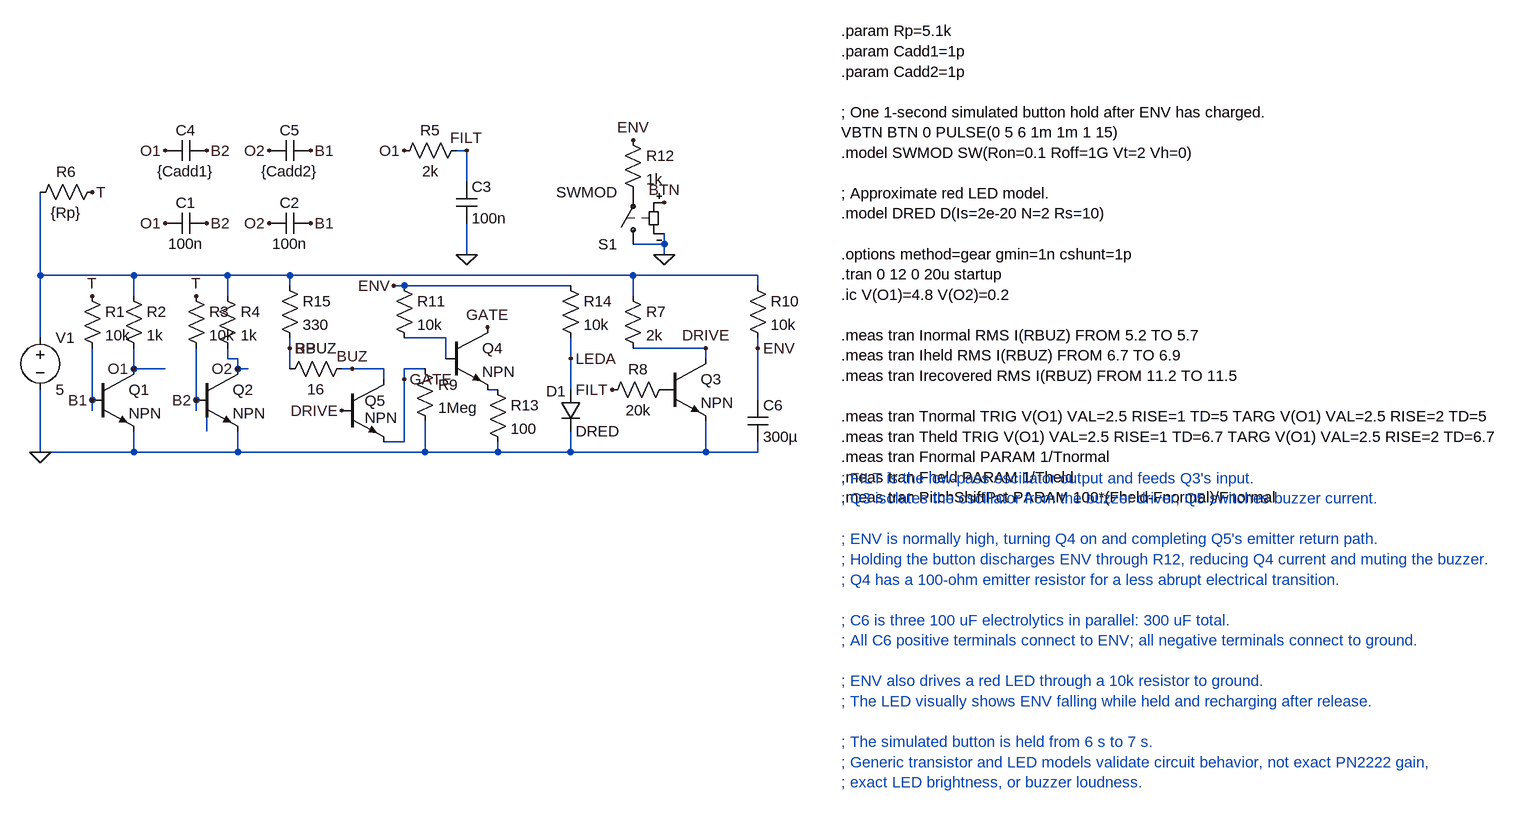
[diagram p0: schematic analog-oscillator-v8.asc]
analog-oscillator-v8.asc, the LTspice schematic file:
Version 4.1
SHEET 1 3092 936
WIRE 768 -224 752 -224
WIRE 768 -176 768 -224
WIRE 1072 -80 1072 -96
WIRE 1072 -80 1024 -80
WIRE 768 -64 768 -112
WIRE 1072 -64 1072 -80
WIRE 112 -32 112 -160
WIRE 256 -32 112 -32
WIRE 400 -32 256 -32
WIRE 496 -32 400 -32
WIRE 1024 -32 496 -32
WIRE 1216 -32 1024 -32
WIRE 496 -16 496 -32
WIRE 672 -16 656 -16
WIRE 928 -16 672 -16
WIRE 1216 -16 1216 -32
WIRE 256 0 256 -32
WIRE 400 0 400 -32
WIRE 1024 0 1024 -32
WIRE 112 64 112 -32
WIRE 736 64 672 64
WIRE 496 80 496 64
WIRE 1136 80 1024 80
WIRE 1216 80 1216 64
WIRE 400 96 400 80
WIRE 416 96 400 96
WIRE 736 96 736 64
WIRE 928 96 928 64
WIRE 1136 96 1136 80
WIRE 256 112 256 80
WIRE 304 112 256 112
WIRE 416 112 416 96
WIRE 432 112 416 112
WIRE 496 112 496 80
WIRE 592 112 576 112
WIRE 640 112 592 112
WIRE 704 112 672 112
WIRE 640 128 640 112
WIRE 672 128 672 112
WIRE 816 144 800 144
WIRE 928 144 928 96
WIRE 192 160 192 80
WIRE 352 160 352 80
WIRE 1216 160 1216 80
WIRE 192 176 192 160
WIRE 352 176 352 160
WIRE 368 208 368 160
WIRE 672 224 672 128
WIRE 672 224 640 224
WIRE 112 240 112 144
WIRE 256 240 256 208
WIRE 256 240 112 240
WIRE 416 240 416 208
WIRE 416 240 256 240
WIRE 704 240 704 192
WIRE 704 240 416 240
WIRE 816 240 816 224
WIRE 816 240 704 240
WIRE 928 240 928 208
WIRE 928 240 816 240
WIRE 1136 240 1136 192
WIRE 1136 240 928 240
WIRE 1216 240 1216 224
WIRE 1216 240 1136 240
FLAG 112 240 0
FLAG 256 112 O1
FLAG 416 112 O2
FLAG 464 -112 O2
FLAG 304 -112 O1
FLAG 192 160 B1
FLAG 368 -112 B2
FLAG 352 160 B2
FLAG 528 -112 B1
FLAG 672 -224 O1
FLAG 768 -224 FILT
FLAG 768 -64 0
FLAG 192 -160 T
FLAG 304 -224 O1
FLAG 368 -224 B2
FLAG 464 -224 O2
FLAG 528 -224 B1
FLAG 192 0 T
FLAG 352 0 T
FLAG 496 80 BP
FLAG 592 112 BUZ
FLAG 576 176 DRIVE
FLAG 1136 80 DRIVE
FLAG 992 144 FILT
FLAG 672 128 GATE
FLAG 1216 80 ENV
FLAG 800 48 GATE
FLAG 656 -16 ENV
FLAG 1072 -64 0
FLAG 1072 -144 BTN
FLAG 1024 -240 ENV
FLAG 928 96 LEDA
SYMBOL voltage 112 48 R0
WINDOW 123 0 0 Left 0
WINDOW 39 0 0 Left 0
SYMATTR InstName V1
SYMATTR Value 5
SYMBOL res 176 -16 R0
SYMATTR InstName R1
SYMATTR Value 10k
SYMBOL res 240 -16 R0
SYMATTR InstName R2
SYMATTR Value 1k
SYMBOL res 336 -16 R0
SYMATTR InstName R3
SYMATTR Value 10k
SYMBOL res 384 -16 R0
SYMATTR InstName R4
SYMATTR Value 1k
SYMBOL npn 192 112 R0
SYMATTR InstName Q1
SYMBOL npn 352 112 R0
SYMATTR InstName Q2
SYMBOL cap 304 -96 R270
WINDOW 0 32 32 VTop 2
WINDOW 3 0 32 VBottom 2
SYMATTR InstName C1
SYMATTR Value 100n
SYMBOL cap 464 -96 R270
WINDOW 0 32 32 VTop 2
WINDOW 3 0 32 VBottom 2
SYMATTR InstName C2
SYMATTR Value 100n
SYMBOL res 768 -240 R90
WINDOW 0 0 56 VBottom 2
WINDOW 3 32 56 VTop 2
SYMATTR InstName R5
SYMATTR Value 2k
SYMBOL cap 752 -176 R0
SYMATTR InstName C3
SYMATTR Value 100n
SYMBOL res 96 -144 R270
WINDOW 0 32 56 VTop 2
WINDOW 3 0 56 VBottom 2
SYMATTR InstName R6
SYMATTR Value {Rp}
SYMBOL cap 368 -240 R90
WINDOW 0 0 32 VBottom 2
WINDOW 3 32 32 VTop 2
SYMATTR InstName C4
SYMATTR Value {Cadd1}
SYMBOL cap 528 -240 R90
WINDOW 0 0 32 VBottom 2
WINDOW 3 32 32 VTop 2
SYMATTR InstName C5
SYMATTR Value {Cadd2}
SYMBOL npn 576 128 R0
WINDOW 0 35 33 Left 2
WINDOW 3 35 59 Left 2
SYMATTR InstName Q5
SYMBOL res 480 -32 R0
SYMATTR InstName R15
SYMATTR Value 330
SYMBOL res 592 96 R90
WINDOW 0 0 56 VBottom 2
WINDOW 3 32 56 VTop 2
SYMATTR InstName RBUZ
SYMATTR Value 16
SYMBOL npn 736 48 R0
SYMATTR InstName Q4
SYMBOL npn 1072 96 R0
SYMATTR InstName Q3
SYMBOL res 1008 -16 R0
SYMATTR InstName R7
SYMATTR Value 2k
SYMBOL res 1088 128 R90
WINDOW 0 0 56 VBottom 2
WINDOW 3 32 56 VTop 2
SYMATTR InstName R8
SYMATTR Value 20k
SYMBOL res 688 96 R0
SYMATTR InstName R9
SYMATTR Value 1Meg
SYMBOL res 1200 -32 R0
SYMATTR InstName R10
SYMATTR Value 10k
SYMBOL cap 1200 160 R0
SYMATTR InstName C6
SYMATTR Value 300µ
SYMBOL res 656 -32 R0
SYMATTR InstName R11
SYMATTR Value 10k
SYMBOL sw 1024 -64 R180
SYMATTR InstName S1
SYMATTR Value SWMOD
SYMBOL res 1008 -256 R0
SYMATTR InstName R12
SYMATTR Value 1k
SYMBOL res 800 128 R0
SYMATTR InstName R13
SYMATTR Value 100
SYMBOL res 912 -32 R0
SYMATTR InstName R14
SYMATTR Value 10k
SYMBOL diode 912 144 R0
WINDOW 0 -22 2 Left 2
SYMATTR InstName D1
SYMATTR Value DRED
TEXT 1344 -408 Left 2 !.param Rp=5.1k\n.param Cadd1=1p\n.param Cadd2=1p\n \n; One 1-second simulated button hold after ENV has charged.\nVBTN BTN 0 PULSE(0 5 6 1m 1m 1 15)\n.model SWMOD SW(Ron=0.1 Roff=1G Vt=2 Vh=0)\n \n; Approximate red LED model.\n.model DRED D(Is=2e-20 N=2 Rs=10)\n \n.options method=gear gmin=1n cshunt=1p\n.tran 0 12 0 20u startup\n.ic V(O1)=4.8 V(O2)=0.2\n \n.meas tran Inormal RMS I(RBUZ) FROM 5.2 TO 5.7\n.meas tran Iheld RMS I(RBUZ) FROM 6.7 TO 6.9\n.meas tran Irecovered RMS I(RBUZ) FROM 11.2 TO 11.5\n \n.meas tran Tnormal TRIG V(O1) VAL=2.5 RISE=1 TD=5 TARG V(O1) VAL=2.5 RISE=2 TD=5\n.meas tran Theld TRIG V(O1) VAL=2.5 RISE=1 TD=6.7 TARG V(O1) VAL=2.5 RISE=2 TD=6.7\n.meas tran Fnormal PARAM 1/Tnormal\n.meas tran Fheld PARAM 1/Theld\n.meas tran PitchShiftPct PARAM 100*(Fheld-Fnormal)/Fnormal
TEXT 1344 280 Left 2 ;; FILT is the low-pass oscillator output and feeds Q3's input.\n; Q3 isolates the oscillator from the buzzer driver; Q5 switches buzzer current.\n \n; ENV is normally high, turning Q4 on and completing Q5's emitter return path.\n; Holding the button discharges ENV through R12, reducing Q4 current and muting the buzzer.\n; Q4 has a 100-ohm emitter resistor for a less abrupt electrical transition.\n \n; C6 is three 100 uF electrolytics in parallel: 300 uF total.\n; All C6 positive terminals connect to ENV; all negative terminals connect to ground.\n \n; ENV also drives a red LED through a 10k resistor to ground.\n; The LED visually shows ENV falling while held and recharging after release.\n \n; The simulated button is held from 6 s to 7 s.\n; Generic transistor and LED models validate circuit behavior, not exact PN2222 gain,\n; exact LED brightness, or buzzer loudness.

The netlist it stands for:
* analog-oscillator-v8.asc
V1 N001 0 5
R1 T B1 10k
R2 N001 O1 1k
R3 T B2 10k
R4 N001 O2 1k
Q1 O1 B1 0 0 NPN
Q2 O2 B2 0 0 NPN
C1 O1 B2 100n
C2 O2 B1 100n
R5 FILT O1 2k
C3 FILT 0 100n
R6 N001 T {Rp}
C4 B2 O1 {Cadd1}
C5 B1 O2 {Cadd2}
Q5 BUZ DRIVE GATE 0 NPN
R15 N001 BP 330
RBUZ BUZ BP 16
Q4 GATE N002 N003 0 NPN
Q3 DRIVE P001 0 0 NPN
R7 N001 DRIVE 2k
R8 P001 FILT 20k
R9 GATE 0 1Meg
R10 N001 ENV 10k
C6 ENV 0 300µ
R11 ENV N002 10k
S1 0 P002 BTN 0 SWMOD
R12 ENV P002 1k
R13 N003 0 100
R14 ENV LEDA 10k
D1 LEDA 0 DRED
.model D D
.lib standard.dio
.model NPN NPN
.model PNP PNP
.lib standard.bjt
.param Rp=5.1k
.param Cadd1=1p
.param Cadd2=1p
; One 1-second simulated button hold after ENV has charged.
VBTN BTN 0 PULSE(0 5 6 1m 1m 1 15)
.model SWMOD SW(Ron=0.1 Roff=1G Vt=2 Vh=0)
; Approximate red LED model.
.model DRED D(Is=2e-20 N=2 Rs=10)
.options method=gear gmin=1n cshunt=1p
.tran 0 12 0 20u startup
.ic V(O1)=4.8 V(O2)=0.2
.meas tran Inormal RMS I(RBUZ) FROM 5.2 TO 5.7
.meas tran Iheld RMS I(RBUZ) FROM 6.7 TO 6.9
.meas tran Irecovered RMS I(RBUZ) FROM 11.2 TO 11.5
.meas tran Tnormal TRIG V(O1) VAL=2.5 RISE=1 TD=5 TARG V(O1) VAL=2.5 RISE=2 TD=5
.meas tran Theld TRIG V(O1) VAL=2.5 RISE=1 TD=6.7 TARG V(O1) VAL=2.5 RISE=2 TD=6.7
.meas tran Fnormal PARAM 1/Tnormal
.meas tran Fheld PARAM 1/Theld
.meas tran PitchShiftPct PARAM 100*(Fheld-Fnormal)/Fnormal
* ; FILT is the low-pass oscillator output and feeds Q3's input.
* ; Q3 isolates the oscillator from the buzzer driver; Q5 switches buzzer current.
* ; ENV is normally high, turning Q4 on and completing Q5's emitter return path.
* ; Holding the button discharges ENV through R12, reducing Q4 current and muting the buzzer.
* ; Q4 has a 100-ohm emitter resistor for a less abrupt electrical transition.
* ; C6 is three 100 uF electrolytics in parallel: 300 uF total.
* ; All C6 positive terminals connect to ENV; all negative terminals connect to ground.
* ; ENV also drives a red LED through a 10k resistor to ground.
* ; The LED visually shows ENV falling while held and recharging after release.
* ; The simulated button is held from 6 s to 7 s.
* ; Generic transistor and LED models validate circuit behavior, not exact PN2222 gain,
* ; exact LED brightness, or buzzer loudness.
.backanno
.end